# EasyEDA Pro project zhuban.epro, board PCB1
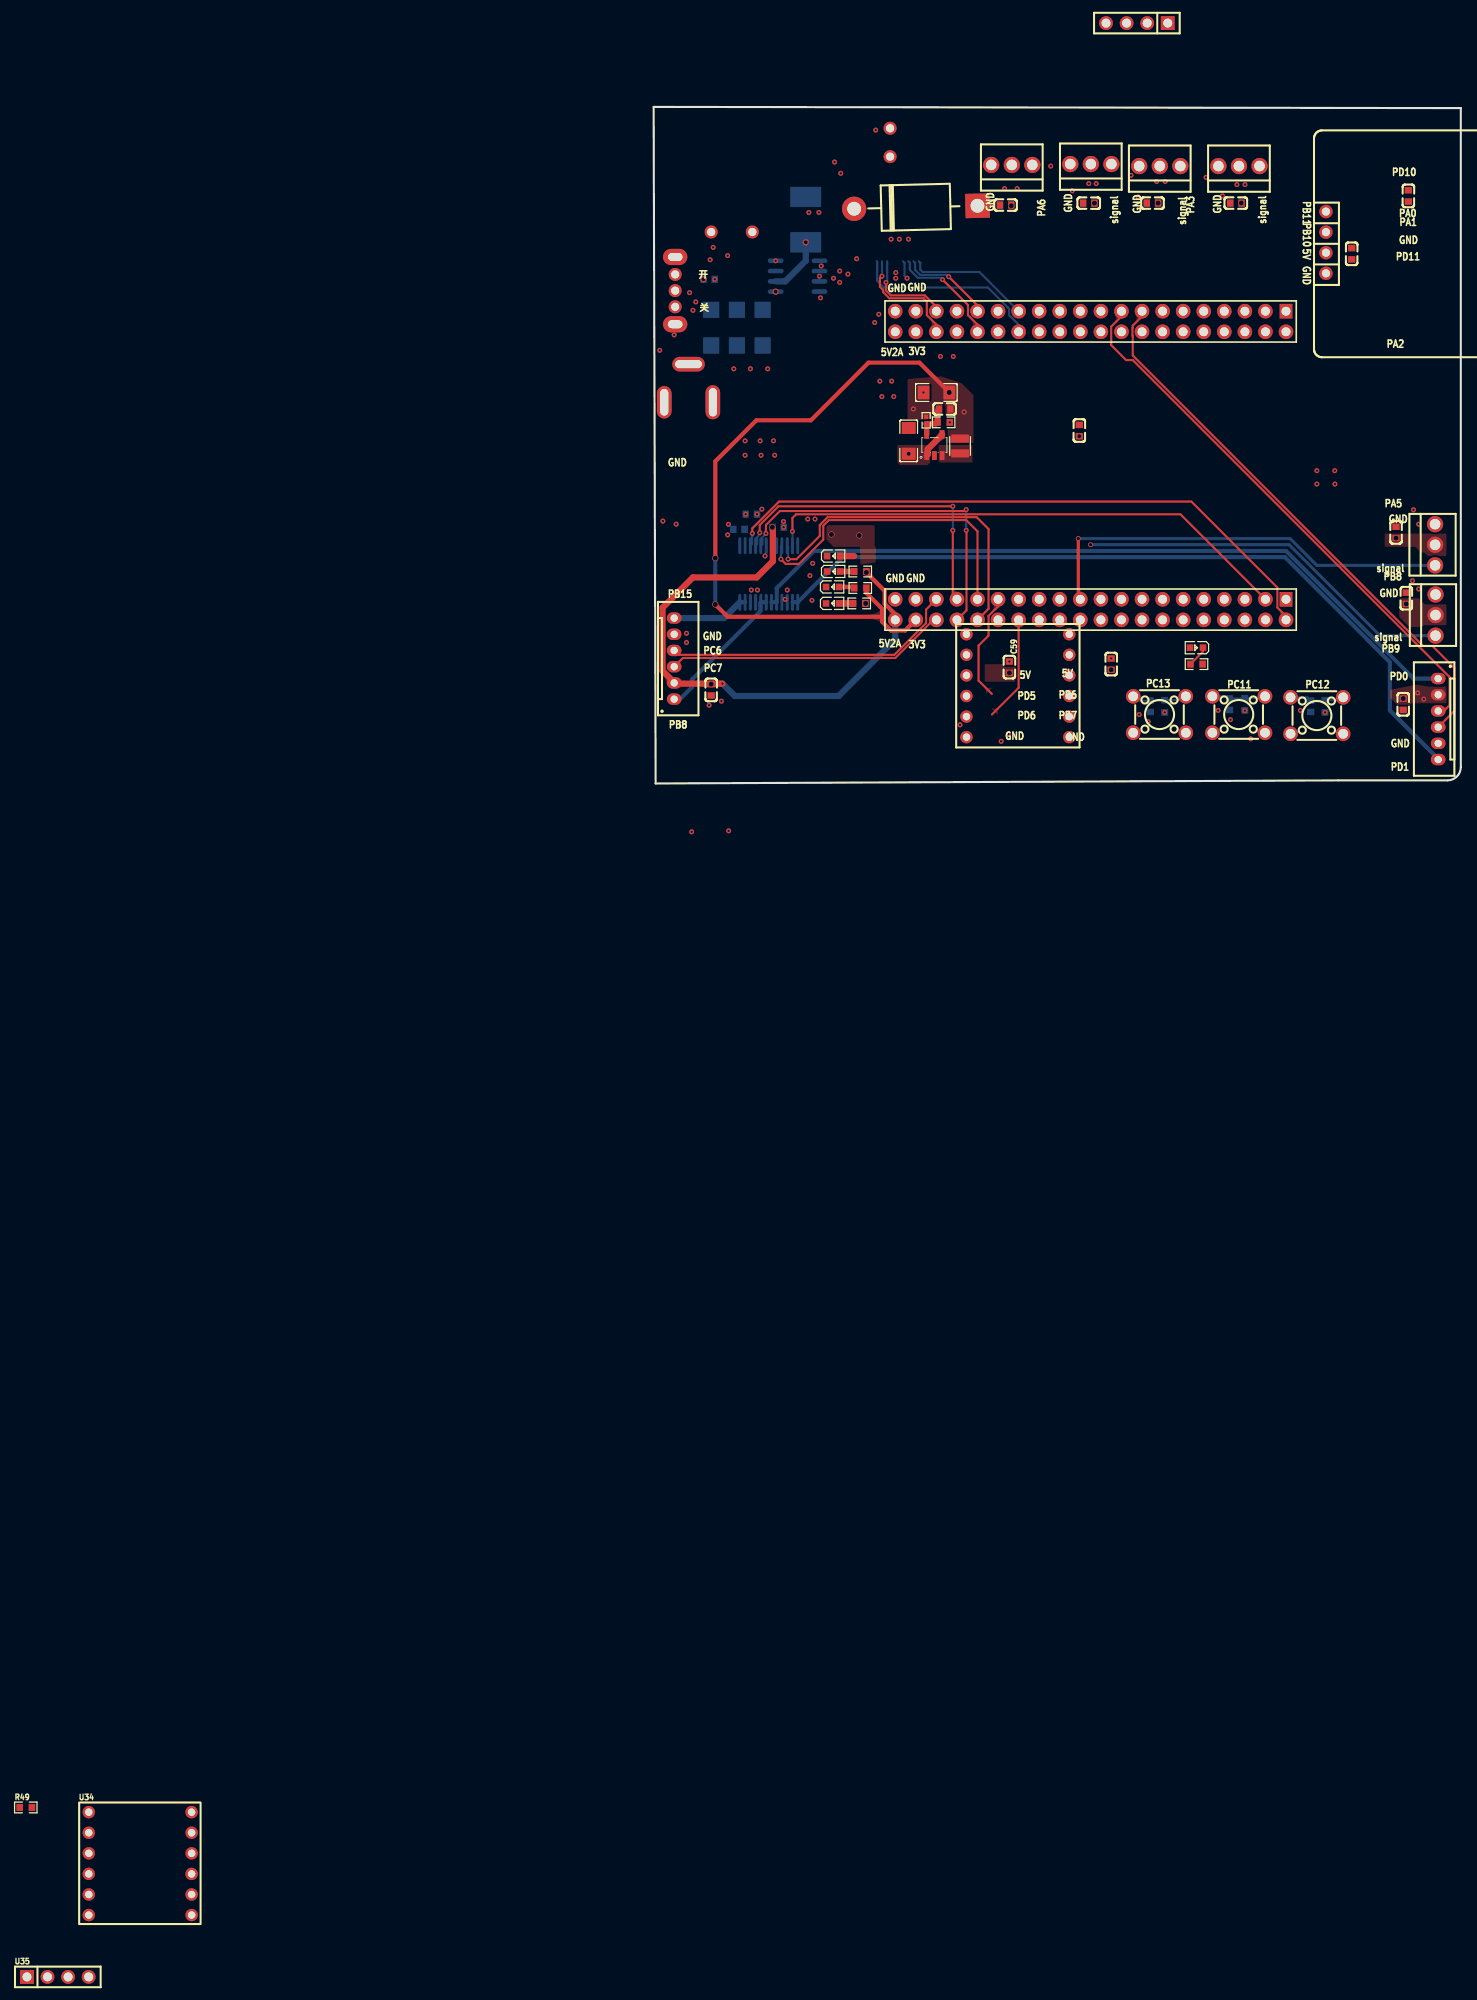
[diagram p3: board, top side]
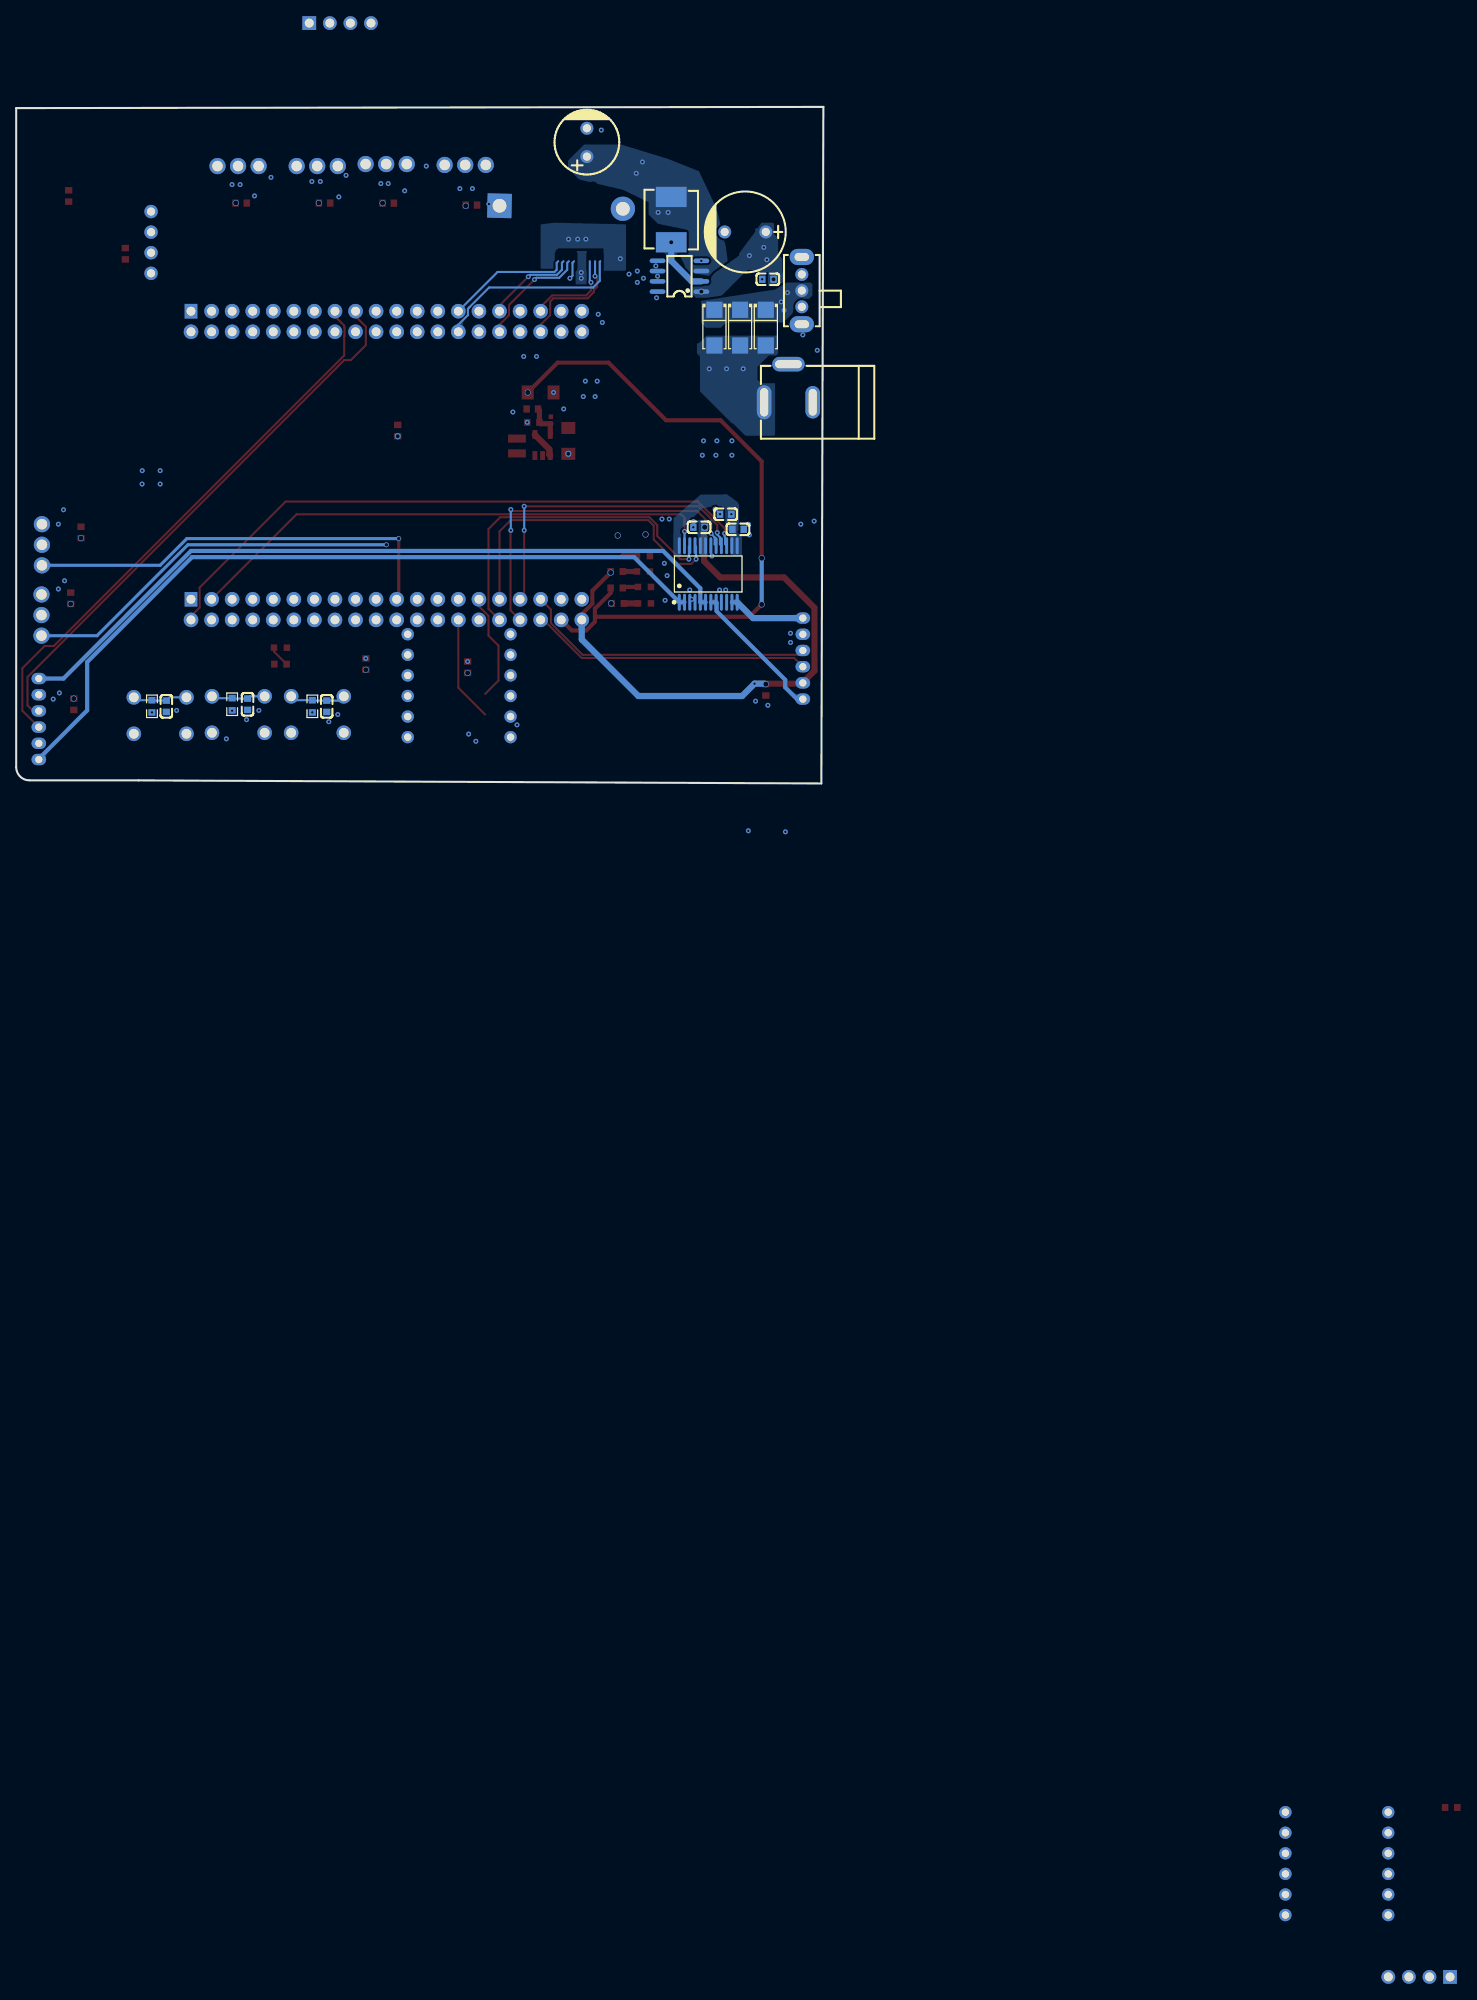
[diagram p4: board, bottom side, seen from below]

Outline 99.69 x 83.51 mm; copper layers: Top Layer, Inner1, Inner2, Bottom Layer. Coordinates in mm from the lower left corner of the outline.
Outline path: 0,83.51 0.25,0 84.58,0.38 98.06,0.39 arc(99.21,0.86) 99.69,2.01 99.69,83.36 0,83.51
Stack: Top Layer 0.035mm 外层铜厚1oz / Dielectric1 0.2104mm 7628 RC49% 8.6mil / Inner1 0.0152mm 内层铜厚 / Dielectric2 1.065mm 1.1mm H/HOZ Copper / Inner2 0.0152mm 内层铜厚 / Dielectric3 0.2104mm 7628 RC49% 8.6mil / Bottom Layer 0.035mm 外层铜厚1oz

## Design rules (mm)
template: 自定义配置
spacing copperThickness1oz (default): track to track 0.102, other pairs 0.152 to 0.3
spacing copperThickness2oz: track to track 0.203, other pairs 0.152 to 0.3
track width copperThickness1oz (default): min 0.127, default 0.254, max 2.54
track width copperThickness2oz: min 0.203, default 0.254, max 2.54
differential pair differentialPair (default): width min 0.127, default 0.254, max 2.54; gap min 0.152, default 0.152
via viaSize (default): diameter min 0.5, default 0.61, max 10; hole min 0.3, default 0.305, max 6.3
net 12V uses sad
net $3N121 uses sad
net 5V2A uses sad
net 3V3 uses sad
net $3N5291 uses sad
net $3N5391 uses sad
net 5V3A uses sad

## Placement (name value [footprint] x y rotation side)
C6  470uF  [CAP-TH_BD10.0-P5.00-D1.0-FD]  9.65 68.07 0 bottom
C7  1uF  [C0603]  6.85 62.23 180 bottom
C8  180uF  [CAP-TH_BD8.0-P3.50-D0.6-FD]  29.2 79.12 90 bottom
C25  22uF  [C1206]  31.5 42.29 270 top
C26  22uF  [C1206]  34.92 48.26 180 top
C27  100pF  [C0603]  35.95 46.22 0 top
C33  100nF  [C0603]  12.07 33.23 0 bottom
C34  10uF  [C0603]  10.54 31.37 180 bottom
C35  100nF  [C0603]  15.36 31.62 0 bottom
C39  100nF  [C0603]  93.21 72.52 270 top
C40  100nF  [C0603]  61.61 71.64 180 top
C42  100nF  [C0603]  53.74 71.63 0 top
C43  100nF  [C0603]  86.21 65.38 90 top
C44  100nF  [C0603]  7.11 11.56 90 top
C45  100nF  [C0603]  92.58 9.78 90 top
C46  100nF  [C0603]  71.91 71.63 0 top
C48  100nF  [C0603]  52.57 43.56 270 top
C49  100nF  [C0603]  56.51 14.73 270 top
C53  100nF  [C0603]  91.69 30.99 270 top
C54  100nF  [C0603]  92.96 22.86 270 top
C55  100nF  [C0603]  71.11 9.78 90 bottom
C56  100nF  [C0603]  61.34 9.53 90 bottom
C57  100nF  [C0603]  81.15 9.53 90 bottom
C58  100nF  [C0603]  43.47 71.39 0 top
C59  100nF  [C0603]  43.94 14.35 270 top
CN1  PH2.0-6P  [PH2.0-6P 直针端子座]  2.53 10.41 90 top
CN3  PH2.0-6P  [PH2.0-6P 直针端子座]  96.9 12.95 270 top
CN5  640456-3  [CONN-TH_640456-3]  72.29 76.21 0 top
CN6  640456-3  [CONN-TH_640456-3]  62.51 76.21 0 top
CN7  640456-3  [CONN-TH_640456-3]  54 76.45 0 top
CN8  640456-3  [CONN-TH_640456-3]  44.23 76.35 0 top
CN14  640456-3  [CONN-TH_640456-3]  96.52 29.46 270 top
CN15  640456-3  [CONN-TH_640456-3]  96.57 20.79 270 top
D2  SS34  [SMA_L4.3-W2.6-LS5.2-RD]  10.28 56.26 270 bottom
D3  SS34  [SMA_L4.3-W2.6-LS5.2-RD]  7.11 56.26 270 bottom
D4  SS34  [SMA_L4.3-W2.6-LS5.2-RD]  13.46 56.26 270 bottom
DC1  DC-005-5A-2.0  [DC-IN-TH_DC-005-5A-2.0]  4.31 49.4 0 bottom
L2  68uH  [IND-SMD_L7.1-W6.6-1]  18.79 69.6 270 bottom
L3  2.2uH  [IND-SMD_L2.5-W2.0_MHCD252012A]  37.84 41.66 90 top
LED1  XL-1608SURC-06  [LED0603-RD_RED]  22.22 28.07 0 top
LED3  XL-1608SURC-06  [LED0603-RD_RED]  22.22 26.16 0 top
LED8  XL-1608SURC-06  [LED0603-RD_RED]  22.09 22.22 0 top
LED9  XL-1608SURC-06  [LED0603-RD_RED]  22.09 24.26 0 top
LED10  XL-1608SURC-06  [LED0603-RD_RED]  67.05 16.76 180 top
OLED1  -  [0.96OLED_4P]  83.04 66.78 90 top
R5  10kΩ  [R0603]  25.52 26.16 180 top
R29  10kΩ  [R0603]  73.02 9.78 270 bottom
R31  450kΩ  [R0402]  33.66 44.83 90 top
R32  100kΩ  [R0603]  35.82 44.57 0 top
R44  10kΩ  [R0603]  25.39 22.22 180 top
R45  10kΩ  [R0603]  25.52 24.13 180 top
R46  10kΩ  [R0603]  67.05 14.73 0 top
R47  10kΩ  [R0603]  63.11 9.53 270 bottom
R48  10kΩ  [R0603]  82.93 9.53 270 bottom
R49  10kΩ  [R0603]  -77.54 -126.39 0 top
SW1  SK12D07VG5  [SW-TH_SK12D07VG5]  2.66 60.83 90 bottom
SW4  K2-1102DP-Z4SW-04  [SW-TH_4P-L6.0-W6.0-P4.50-LS6.5]  72.26 8.51 0 top
SW5  K2-1102DP-Z4SW-04  [SW-TH_4P-L6.0-W6.0-P4.50-LS6.5]  62.48 8.51 0 top
SW6  K2-1102DP-Z4SW-04  [SW-TH_4P-L6.0-W6.0-P4.50-LS6.5]  81.91 8.38 0 top
U3  XL1509-5.0E1  [SOIC-8_L5.0-W4.0-P1.27-LS6.0-BL]  17.77 62.61 90 bottom
U4  1N5820-E3/54  [DO-201AD_BD5.3-L8.4-P12.50-D1.4-FD]  32.38 71.12 181.4 top
U23  WTH01  [JY901]  45.59 12.32 0 top
U24  ME3103AM5G  [SOT-23-5_L3.0-W1.7-P0.95-LS2.8-BR]  34.68 41.78 270 top
U28  TB6612FNG(O,C,8,EL  [SSOP-24_L8.4-W5.8-P0.65-LS7.8-BL]  14.22 25.86 180 bottom
U31  PZ2.54-2*20  [HDR-TH_40P-P2.54-V-M-R2-C20-S2.54]  53.97 21.46 180 top
U32  PZ2.54-2*20  [HDR-TH_40P-P2.54-V-M-R2-C20-S2.54]  53.97 57.02 180 top
U33  PM254-1-04-Z-8.5  [HDR-TH_4P-P2.54-V-F]  59.68 93.85 180 top
U34  JY901  [JY901#2]  -65.95 -130.78 0 top
U35  PM254-1-04-Z-8.5  [HDR-TH_4P-P2.54-V-F]  -73.58 -147.3 0 top

## Footprints (pads in the part's own frame, mm; a bottom-side part is the same pattern mirrored in y, then rotated)
0.96OLED_4P
  round 1.651 hole 1.001: 1(-3.81,0) 2(-1.27,0.003) 3(1.27,0.003) 4(3.81,0.003)
C0603
  rect 0.8x0.9 smd: 1(-0.7,0) 2(0.7,0)
C1206
  rect 1.485x1.728 smd: 1(-1.593,0) 2(1.593,0)
CAP-TH_BD8.0-P3.50-D0.6-FD
  round 1.6 hole 1: 1(-1.75,0) 2(1.75,0)
CAP-TH_BD10.0-P5.00-D1.0-FD
  round 1.6 hole 1: 1(-2.54,0) 2(2.54,0)
CONN-TH_640456-3
  round 2 hole 1.3: 1(-2.54,0) 2(0,0) 3(2.54,0)
DC-IN-TH_DC-005-5A-2.0
  oval 1.8x4.2 hole 1x3.5: 1(3,2.352)
  oval 1.8x4 hole 1x3.3: 2(-3,2.352)
  oval 4x1.8 hole 3.3x1: 3(-0.001,-2.352)
DO-201AD_BD5.3-L8.4-P12.50-D1.4-FD
  rect 3x3 hole 1.7: 1(-7.62,0)
  round 3 hole 1.7: 2(7.62,0)
HDR-TH_4P-P2.54-V-F
  rect 1.7x1.7 hole 1.1: 1(-3.81,0)
  round 1.7 hole 1.1: 2(-1.27,0) 3(1.27,0) 4(3.81,0)
HDR-TH_40P-P2.54-V-M-R2-C20-S2.54
  rect 1.575x1.8 hole 1.1: 1(-24.13,-1.27)
  round 1.8 hole 1.1: 2(-24.13,1.27) 3(-21.59,-1.27) 4(-21.59,1.27) 5(-19.05,-1.27) 6(-19.05,1.27) 7(-16.51,-1.27) 8(-16.51,1.27) 9(-13.97,-1.27) 10(-13.97,1.27) 11(-11.43,-1.27) 12(-11.43,1.27) 13(-8.89,-1.27) 14(-8.89,1.27) 15(-6.35,-1.27) 16(-6.35,1.27) 17(-3.81,-1.27) 18(-3.81,1.27) 19(-1.27,-1.27) 20(-1.27,1.27) 21(1.27,-1.27) 22(1.27,1.27) 23(3.81,-1.27) 24(3.81,1.27) 25(6.35,-1.27) 26(6.35,1.27) 27(8.89,-1.27) 28(8.89,1.27) 29(11.43,-1.27) 30(11.43,1.27) 31(13.97,-1.27) 32(13.97,1.27) 33(16.51,-1.27) 34(16.51,1.27) 35(19.05,-1.27) 36(19.05,1.27) 37(21.59,-1.27) 38(21.59,1.27) 39(24.13,-1.27) 40(24.13,1.27)
IND-SMD_L2.5-W2.0_MHCD252012A
  rect 1x2.2 smd: 1(0.913,0) 2(-0.913,0)
IND-SMD_L7.1-W6.6-1
  rect 2.5x3.8 smd: 1(-2.8,0) 2(2.8,0)
JY901
  round 1.524 hole 0.914: 1(-6.954,6.1) 2(-6.954,3.56) 3(-6.954,1.02) 4(-6.954,-1.52) 5(-6.954,-4.06) 6(-6.954,-6.6) 7(5.747,-6.6) 8(5.747,-4.06) 9(5.747,-1.52) 10(5.747,1.02) 11(5.747,3.56) 12(5.747,6.1)
JY901#2
  round 1.524 hole 0.914: 1(-3.81,3.81) 2(-3.81,1.27) 3(-3.81,-1.27) 4(-3.81,-3.81) 5(-3.81,-6.35) 6(-3.81,-8.89) 7(8.89,-8.89) 8(8.89,-6.35) 9(8.89,-3.81) 10(8.89,-1.27) 11(8.89,1.27) 12(8.89,3.81)
LED0603-RD_RED
  rect 0.8x0.8 smd: 1(-0.799,-0.004) 2(0.799,0.004)
PH2.0-6P 直针端子座
  oval 1.4x1.8 hole 0.9: 1(0,0) 2(2,0) 3(4,0) 4(6,0) 5(8,0) 6(10,0)
R0402
  rect 0.566x0.54 smd: 1(-0.433,0) 2(0.433,0)
R0603
  rect 0.806x0.864 smd: 1(-0.753,0) 2(0.753,0)
SMA_L4.3-W2.6-LS5.2-RD
  rect 2x2 smd: 1(-2.2,0) 2(2.2,0)
SOIC-8_L5.0-W4.0-P1.27-LS6.0-BL
  oval 0.569x1.95 smd: 1(-1.905,-2.705) 2(-0.635,-2.705) 3(0.635,-2.705) 4(1.905,-2.705) 5(1.905,2.705) 6(0.635,2.705) 7(-0.635,2.705) 8(-1.905,2.705)
SOT-23-5_L3.0-W1.7-P0.95-LS2.8-BR
  rect 1.1x0.6 smd: 1(1.3,-0.95) 2(1.3,0) 3(1.3,0.95) 4(-1.3,0.95) 5(-1.3,-0.95)
SSOP-24_L8.4-W5.8-P0.65-LS7.8-BL
  oval 0.364x2.082 smd: 1(-3.575,-3.491) 2(-2.925,-3.491) 3(-2.275,-3.491) 4(-1.625,-3.491) 5(-0.975,-3.491) 6(-0.325,-3.491) 7(0.325,-3.491) 8(0.975,-3.491) 9(1.625,-3.491) 10(2.275,-3.491) 11(2.925,-3.491) 12(3.575,-3.491) 13(3.575,3.491) 14(2.925,3.491) 15(2.275,3.491) 16(1.625,3.491) 17(0.975,3.491) 18(0.325,3.491) 19(-0.325,3.491) 20(-0.975,3.491) 21(-1.625,3.491) 22(-2.275,3.491) 23(-2.925,3.491) 24(-3.575,3.491)
SW-TH_4P-L6.0-W6.0-P4.50-LS6.5
  round 1.8 hole 1.2: 1(-3.25,2.25) 2(3.25,2.25) 3(-3.25,-2.25) 4(3.25,-2.25)
SW-TH_SK12D07VG5
  oval 1.6x1.6 hole 1: 1(-2,0) 2(0,0) 3(2,0)
  oval 2x3 hole 1x1.8: 4(4.15,0) 5(-4.15,0)

## Nets
3V3: C26.1 C27.2 L3.1 R31.2 R45.1 U31.38 U32.38
5V2A: C8.1 C25.2 C35.1 C39.1 C40.1 C42.2 C43.2 C44.2 C45.2 C46.2 C48.2 C49.2 C53.2 C54.2 C58.1 C59.1 CN1.2 CN3.2 CN5.2 CN6.2 CN7.2 CN8.2 CN14.2 CN15.2 L2.1 OLED1.2 R5.1 R29.2 R47.2 R48.2 U3.3 U23.2 U23.11 U24.1 U24.4 U28.19 U28.20 U31.40 U32.40 U33.1 U34.2 U34.11 U35.4
5V3A: R44.1
12V: C6.1 C7.2 C33.1 C34.1 R49.1 SW1.3 U3.1 U28.13 U28.14 U28.24
GND: C6.2 C7.1 C8.2 C25.1 C26.2 C33.2 C34.2 C35.2 C39.2 C40.2 C42.1 C43.1 C44.1 C45.1 C46.1 C48.1 C49.1 C53.1 C54.1 C55.1 C56.1 C57.1 C58.2 C59.2 CN1.5 CN3.5 CN5.1 CN6.1 CN7.1 CN8.1 CN14.1 CN15.1 DC1.2 DC1.3 LED1.1 LED3.1 LED8.1 LED9.1 OLED1.1 R32.2 R46.2 SW1.4 SW1.5 SW4.3 SW4.4 SW5.3 SW5.4 SW6.3 SW6.4 U3.4 U3.5 U3.6 U3.7 U3.8 U4.1 U23.5 U23.8 U24.2 U28.3 U28.4 U28.9 U28.10 U28.18 U31.37 U31.39 U32.37 U32.39 U33.2 U34.5 U34.8 U35.3
AM1: CN1.1 U28.7 U28.8
AM2: CN1.6 U28.11 U28.12
CM1: CN3.1 U28.5 U28.6
CM2: CN3.6 U28.1 U28.2
DUOJI1: CN5.3 U32.8
DUOJI2: CN6.3 U32.6
DUOJI3: CN7.3 U32.1
DUOJI4: CN8.3 U32.7
DUOJI5: CN14.3 U31.21
DUOJI6: CN15.3 U31.20
PA0: U32.3 U35.1
PA1: U32.4 U35.2
PA4: U32.5
PA7: U32.10
PA8: U28.17 U31.34 U34.10
PA9: U34.3
PA10: U34.4
PA15: U28.16 U31.33
PB0: U32.11
PB1: U32.14
PB4: U31.25
PB5: U31.24
PB6: U23.10 U31.23
PB7: U23.9 U31.22
PB10: OLED1.3 U32.23
PB11: OLED1.4 U32.24
PB12: U32.26
PB13: U32.25
PB14: U32.28
PB15: U32.27
PC0: U31.14
PC1: U31.15
PC2: U31.16
PC3: U31.17
PC4: U32.9
PC5: U32.12
PC6: CN1.4 U31.35
PC7: CN1.3 U31.36
PC8: U28.23 U31.3
PC9: U28.15 U31.2 U34.9
PC10: U31.7
PC11: C55.2 R29.1 SW4.1 SW4.2 U31.6
PC12: C57.2 R48.1 SW6.1 SW6.2 U31.4
PC13: C56.2 R47.1 SW5.1 SW5.2 U31.8
PD0: U28.22 U31.32
PD1: U28.21 U31.31
PD2: U31.5
PD3: U31.1
PD4: U31.30
PD5: U23.3 U31.29
PD6: U23.4 U31.28
PD7: U31.27
PD8: U32.30 U33.3
PD9: U32.29 U33.4
PD10: U32.32
PD11: U32.31
PD12: U32.34
PD13: U32.33
PD14: U32.36
PD15: U32.35
PE0: U31.19
PE1: U31.18
PE2: U31.13
PE3: U31.12
PE4: U31.11
PE5: LED10.2 U31.10
PE6: U31.9
PE7: U32.13
PE8: U32.16
PE9: CN3.4 U32.15
PE10: U32.18
PE11: CN3.3 U32.17
PE12: U32.20
PE13: U32.19
PE14: U32.22
PE15: U32.21
$1N5869: U31.26
$1N8897: LED10.1 R46.1
$3N121: D2.1 D3.1 D4.1 SW1.2
$3N2924: LED1.2 R49.2
$3N3138: LED3.2 R5.2
$3N5291: L3.2 U24.3
$3N5292: C27.1 R31.1 R32.1 U24.5
$3N5298: LED9.2 R45.2
$3N5391: D2.2 D3.2 D4.2 DC1.1
$3N6658: L2.2 U3.2 U4.2
$3N9579: LED8.2 R44.2

Pads without a net: SW1 1; U23 1 6 7 12; U32 2; U34 1 6 7 12

## Via types
v1: diameter 0.61, hole 0.305, Top Layer to Bottom Layer, 129 vias
v2: diameter 0.762, hole 0.508, Top Layer to Bottom Layer, 5 vias
v3: diameter 0.762, hole 0.635, Top Layer to Bottom Layer, 18 vias
v4: diameter 0.61, hole 0.432, Top Layer to Bottom Layer, 2 vias

## Routing (per net, layer and track width the routed paths; a pad name or vN(x,y) marks a point on that pad's centre or on a via; arc(x,y) is an arc through that point)
3V3: length 84.5
  Top Layer w0.508: 32.38,20.19 31.07,18.89 29.3,18.89 28.21,19.97 28.21,20.6 ; 28.21,20.6 28.21,21.57 26.28,23.51 R45.1 ; 28.21,20.6 28.19,20.57 9.14,20.57 v3(7.61,22.1) ; v3(36.51,48.26) 32.83,51.94 26.54,51.94 19.43,44.83 12.69,44.83 7.61,39.75 v3(7.61,27.81)
  Bottom Layer w0.508: v3(7.61,27.81) v3(7.61,22.1)
  vias: v1(32.08,46.23) v1(35.43,52.7) v1(37.01,52.7) v1(38.35,45.85)
5V2A: length 75.2
  Top Layer w0.508: v3(26.28,26.03) 28.53,23.78 28.53,22.19 29.84,20.89 U31.40
  Top Layer w0.762: 14.73,31.5 14.73,27.43 12.73,25.43 4.85,25.43 1.1,21.68 1.1,13.9 2.69,12.32 v1(8.5,12.32) ; U24.4 35.63,43.03 33.84,41.25 33.84,40.6 33.73,40.48
  Bottom Layer w0.762: 7.23,12.32 v1(8.5,12.32) 10.03,10.79 22.86,10.79 29.84,17.78 U31.40
  vias: v1(19.17,70.48) v1(20.41,70.48) v1(22.35,76.71) v1(23.11,75.31) v1(27.93,49.66) v1(28.19,47.75) v1(29.4,49.66) v1(29.66,47.75) v1(29.91,63.06) v1(29.9,62.36) v1(43.35,73.42) v1(43.94,15.05) v1(44.9,73.42) v1(53.74,74.04) v1(54.66,74.04) v1(62.13,74.3) v1(63.11,8.77) v1(63.18,74.3) v1(69.72,9.02) v1(71.24,7.87) v1(72.04,73.92) v1(73.03,73.92) v1(73.02,8.98) v1(73.74,5.51) v1(79.88,9.02) v1(81.91,38.61) v1(81.91,36.96) v1(82.93,8.77) v1(84.13,38.61) v1(84.14,36.96) v1(94.36,11.18) v1(95.12,10.41) v2(31.5,40.69) v2(52.57,42.86) v3(7.11,12.26) v3(14.66,31.62) v3(54.44,71.63) v3(56.51,14.03) v3(62.31,71.64) v3(72.57,71.65) v3(91.69,30.29) v3(92.58,10.48) v3(92.96,22.16)
5V3A:
  vias: v3(26.19,22.22)
12V:
  vias: v1(6.98,64.64) v1(7.36,66.17) v1(9.14,65.15) v1(11.3,42.29) v1(11.3,40.51) v1(11.37,33.23) v1(13.15,42.29) v1(13.27,40.51) v1(14.8,42.29) v1(14.95,40.51) v1(19.03,32.64) v1(19.93,32.64) v1(22.22,62.36) v1(22.98,63.25) v1(22.98,61.85) v1(24,62.86) v1(25.08,64.77) v1(29.33,67.18) v1(30.35,67.18) v1(31.48,67.18) v2(6.15,62.23) v2(15.07,60.71) v3(21.97,30.73) v3(25.39,30.61)
GND: length 2.3
  Bottom Layer w0.254: v1(31.3,62.36) 30.98,62.68 30.98,64.27 30.8,64.45
  vias: v1(0.76,53.47) v1(1.14,32.38) v1(2.53,55.37) v1(2.79,32) v1(4.06,18.54) v1(4.06,17.4) v1(4.69,-5.97) v1(6.85,9.65) v1(7.55,62.23) v1(8.38,10.16) v1(9.24,31.99) v1(9.15,30.68) v1(9.27,-5.84) v1(12.06,23.88) v1(12.77,33.23) v1(12.82,23.88) v1(13.37,33.85) v1(13.76,28.08) v1(15.07,64.52) v1(16.04,32.33) v1(16.06,31.62) v1(16.25,22.73) v1(16.5,23.88) v1(19.3,25.65) v1(19.64,27.17) v1(19.55,22.61) v1(20.48,62.61) v1(20.61,59.94) v1(20.7,63.88) v1(27.3,56.9) v1(27.43,80.64) v1(27.81,57.91) v1(33.33,48.26) v1(36.57,44.57) v1(37.84,7.24) v1(41.31,71.52) v1(42.92,5.21) v1(43.81,6.1) v1(49.04,76.2) v1(51.71,73.15) v1(56.51,15.43) v1(58.95,75.06) v1(59.84,72.4) v1(59.97,8.51) v1(61.08,7.62) v1(68.23,74.81) v1(70.26,72.52) v1(93.72,25.02) v1(93.85,33.78) v1(94.48,32) v1(94.48,24) v3(43.94,13.65) v3(44.17,71.31)
AM1: length 17.5
  Bottom Layer w0.508: CN1.1 3.25,10.41 4.72,11.88 4.72,12.8 13.18,21.26 13.18,22.31 U28.8 U28.7
AM2: length 9.6
  Bottom Layer w0.508: U28.11 U28.12
  Bottom Layer w0.762: U28.12 8.69,20.41 CN1.6
CM1: length 92.5
  Bottom Layer w0.508: CN3.1 93.85,12.95 78.1,28.7 19.81,28.7 15.2,24.09 U28.5 U28.6
CM2: length 96
  Bottom Layer w0.508: CN3.6 96.9,3.05 90.93,9.02 90.93,14.99 77.97,27.94 23.37,27.94 U28.1 U28.2
DUOJI5: length 53
  Top Layer w0.381: 52.7,22.73 52.45,22.99 v4(52.45,30.23)
  Bottom Layer w0.381: CN14.3 81.91,26.92 78.61,30.23 v4(52.45,30.23)
DUOJI6: length 47.2
  Bottom Layer w0.381: CN15.3 89.7,18.25 78.48,29.46 v4(53.97,29.46)
PA8: length 42.5
  Top Layer w0.254: v1(38.6,31.24) 38.64,31.21 38.64,21.37 U31.34 ; v1(13.87,30.86) 13.87,31.91 15.59,33.63 38.43,33.63 v1(38.6,33.81)
  Bottom Layer w0.254: U28.17 13.44,29.54 13.44,30.4 13.87,30.83 v1(13.87,30.86) ; v1(38.6,33.81) v1(38.6,31.24)
PA15: length 39.3
  Top Layer w0.254: v1(13.11,30.96) 13.11,31.91 15.41,34.21 v1(36.95,34.21) ; v1(36.95,31.24) 36.95,23.24 37.46,22.73
  Bottom Layer w0.254: v1(36.95,34.21) v1(36.95,31.24) ; U28.16 12.79,29.54 12.79,30.4 13.11,30.72 v1(13.11,30.96)
PB14: length 23.5
  Bottom Layer w0.254: 27.55,64.45 27.62,64.39 27.62,62.04 28.44,61.21 41.29,61.21 43.72,58.78 43.72,58.77 43.9,58.58 43.9,57.8 45.08,56.63 U32.28
PB15: length 15.4
  Bottom Layer w0.254: U32.27 40.24,63.13 33.21,63.13 32.94,63.4 32.94,64.27 32.75,64.45
PC6: length 36.4
  Top Layer w0.254: 34.92,22.73 33.65,21.46 33.65,19.8 29.73,15.88 3.07,15.88 CN1.4
PC7: length 34.8
  Top Layer w0.254: CN1.3 3.61,15.49 29.85,15.49 34.55,20.19 34.92,20.19
PC8: length 66.4
  Top Layer w0.254: 75.56,22.73 65.07,33.22 17.6,33.22 17.14,32.77 v1(17.14,31.11)
  Bottom Layer w0.254: v1(17.14,31.11) 17.15,31.11 U28.23
PC9: length 77.3
  Top Layer w0.254: 78.1,20.19 78.1,20.65 77.03,21.72 77.03,24.18 66.42,34.8 15.49,34.8 12.19,31.5 v1(12.19,30.86)
  Bottom Layer w0.254: U28.15 12.14,29.54 12.14,30.4 12.19,30.45 v1(12.19,30.86)
PC11: length 6.7
  Bottom Layer w0.254: SW4.1 70.83,10.76 C55.2 72.97,10.48 R29.1 75.28,10.53 SW4.2
PC12: length 6.8
  Bottom Layer w0.254: SW6.1 80.74,10.63 C57.2 82.87,10.22 R48.1 84.81,10.28 SW6.2
PC13: length 6.9
  Bottom Layer w0.254: SW5.1 59.76,10.22 C56.2 63.06,10.22 R47.1 65.25,10.28 SW5.2
PD0: length 41.8
  Top Layer w0.254: U31.32 41.36,21.55 41.36,31.41 39.9,32.87 21.49,32.87 20.52,31.89 20.52,30.56 17.65,27.69 v1(16.61,27.69)
  Bottom Layer w0.254: U28.22 16.61,29.24 v1(16.61,27.69)
PD1: length 38.4
  Top Layer w0.254: v1(15.72,27.69) 16.3,27.1 17.95,27.1 20.95,30.1 20.95,31.82 21.64,32.51 38.6,32.51 40,31.11 40,22.73
  Bottom Layer w0.254: U28.21 15.72,29.22 v1(15.72,27.69)
PD5: length 13.4
  Top Layer w0.254: 41.78,11.05 40.13,12.7 40.13,17.02 41.36,18.25 41.36,20.68 42.54,21.86 42.54,22.73
PD6: length 13.1
  Top Layer w0.254: 41.78,8.51 45.08,11.81 U31.28
PD10: length 13.9
  Top Layer w0.254: U32.32 40,56.63 38.82,57.8 38.82,59.05 v1(35.68,62.19)
  Bottom Layer w0.254: 31.45,64.45 31.64,64.27 31.64,63.4 32.62,62.42 35.45,62.42 v1(35.68,62.19)
PD11: length 11.4
  Top Layer w0.254: U32.31 40,58.99 v1(36.44,62.55)
  Bottom Layer w0.254: v1(36.44,62.55) 36.22,62.78 32.92,62.78 32.29,63.4 32.29,64.27 32.1,64.45
PD14: length 14.2
  Top Layer w0.254: v1(28.2,62.61) 27.95,62.36 27.95,61.31 28.36,60.9 28.36,60.64 29.11,59.89 33.35,59.89 33.74,59.49 33.74,57.8 34.92,56.63 34.92,55.75
  Bottom Layer w0.254: 28.2,64.45 v1(28.2,62.61)
PD15: length 11.3
  Top Layer w0.254: v1(28.7,61.85) 28.71,61.83 28.71,60.83 29.3,60.24 33.5,60.24 34.92,58.82 34.92,58.29
  Bottom Layer w0.254: v1(28.7,61.85) 28.85,62 28.85,64.45
PE9: length 69.8
  Top Layer w0.254: 60.32,58.29 60.32,57.66 59.18,56.52 59.18,56.28 59.14,56.24 59.14,55.26 59.18,55.23 59.18,52.83 95.04,16.97 96.18,16.97 98.93,14.22 98.93,8.99 CN3.4
PE11: length 68.6
  Top Layer w0.254: CN3.3 97.59,8.95 98.29,9.65 98.29,13.14 59.18,52.26 58.35,52.26 56.51,54.1 56.51,56.39 57.78,57.66 U32.17
$1N8897: length 2.7
  Top Layer w0.254: LED10.1 67.85,16.28 R46.1
$3N121:
  vias: v1(4.44,60.58) v1(4.86,58.4) v1(5.2,59.44)
$3N2924: length 1.8
  Top Layer w0.762: 24.77,28.07 23.02,28.07 LED1.2
$3N3138: length 1.8
  Top Layer w0.635: LED3.2 23.02,26.16 R5.2
$3N5292: length 4.5
  Top Layer w0.635: C27.1 35.07,46.04 R32.1 34.89,44.39 R31.1 33.73,44.33 33.73,43.08
$3N5298: length 1.9
  Top Layer w0.508: 24.77,24.26 22.9,24.26 LED9.2
$3N5391:
  vias: v1(9.9,51.18) v1(11.95,51.18) v1(14.09,51.18)
$3N6658: length 7.1
  Bottom Layer w0.762: U3.2 16.25,61.98 18.79,64.52 v2(18.79,66.8)
$3N9579: length 1.8
  Top Layer w0.762: R44.2 22.9,22.22 LED8.2

## Copper pours and planes (outline as drawn; the poured copper is in the pictures)
3V3 on Top Layer: 34.92,50.22 35.59,50.22 38.04,49.4 39.49,47.95 39.49,42.04 36.23,42.04 36.32,42.13 36.32,43.69 37.33,43.69 37.33,45.34 36.06,45.34 36.06,46.59 36.03,46.63 34.54,46.63 34.54,44.89 31.36,44.89 31.36,49.91 34.16,50.16 34.29,50.16 34.54,50.09
3V3 on Inner1: 37.97,54.23 38.31,47.37 37.08,47.37 35.25,47.57 34.92,52.07 34.67,52.32 33.9,52.32 31.36,54.86 31.36,54.99 31.16,57.02 31.16,57.28 33.4,57.28 33.52,57.15 33.52,55.91 34.69,54.74 37.46,54.74
5V2A on Top Layer: 43.15,70.88 45.12,70.88 45.63,71.39 45.63,76.73 45.51,76.85 45.51,77.74 45.25,78 43.6,78 43.47,78.12 43.09,77.74 42.84,77.74 42.84,71.19
5V2A on Top Layer: 61.87,70.55 61.87,73.79 61.11,74.55 61.11,77.48 61.24,77.6 62.13,77.98 62.49,77.83 63.04,77.83 63.78,77.09 63.78,73.67 63.91,73.54 63.91,70.36 62.05,70.36
5V2A on Top Layer: 90.3,31 90.3,29.21 94.05,29.21 94.74,28.53 95.17,28.53 95.63,28.07 97.79,28.07 97.91,28.19 97.91,30.73 98.04,30.86 90.44,30.86
5V2A on Top Layer: 53.73,70.41 53.35,72.6 53.11,74.17 52.71,76.37 52.73,76.71 52.73,77.72 52.98,77.98 54.27,78.11 54.5,78.11 55.27,77.34 55.27,70.61 55.39,70.48 55.32,70.41
5V2A on Top Layer: 92.25,22.87 94.5,22.87 95.27,22.1 97.91,22.1 97.91,19.53 95.08,19.53 94.86,19.3 93.34,19.3 92.07,20.57 92.07,22.69
5V2A on Top Layer: 44.77,14.36 44.65,14.24 44.65,12.57 40.89,12.57 40.89,14.73 44.39,14.73
5V2A on Top Layer: 30.09,41.66 30.09,39.61 30.41,39.3 33.83,39.3 34.16,39.62 34.16,41.66 34.03,41.78 30.22,41.78
5V2A on Top Layer: 90.93,10.65 90.93,11.56 94.23,12.19 95.75,11.94 97.53,11.94 97.66,12.06 98.4,11.33 98.4,10.5 97.8,9.91 93.59,9.91 93.34,9.65 91.92,9.65
5V2A on Top Layer: 71.9,70.86 70.89,74.17 70.89,76.81 71.02,77.09 72.16,78.24 73.43,78.24 73.81,77.86 73.81,70.62 73.94,70.49 72.27,70.49
5V2A on Bottom Layer: 13.99,62.61 16.76,63.12 17.84,65.46 16.76,65.46 16.76,68.33 20.44,69.09 21.58,70.23 21.58,71.75 24.76,73.28 30.17,74.55 31.53,75.9 31.53,77.09 30.98,77.63 30.98,78.87 28.22,78.87 27.92,79.16 25.94,79.16 19.17,77.09 15.36,75.56 13.2,71.01 12.06,66.33 11.81,64.39
5V2A on Bottom Layer: 15.62,32.54 15.49,28.19 15.37,28.08 14.22,28.08 14.22,30.91 14.01,31.11 13.71,31.11 13.71,32.38 13.86,32.54
5V2A on Bottom Layer: 30.59,61.53 30.59,63.25 30.48,63.37 30.48,65.72 29.27,65.72 29.2,65.79 28.7,61.47 30.45,61.39
12V on Top Layer: 21.33,31.88 21.33,30.1 22.22,29.21 25.39,29.21 25.52,29.08 25.52,27.1 25.57,27.05 27.43,27.28 27.43,29.21 27.3,29.34 27.3,31.75 27.17,31.88
12V on Bottom Layer: 12.06,31.21 11.68,30.83 11.68,28.96 11.55,28.83 11.55,28.37 11.26,28.08 10.05,28.08 10.05,30.43 10.66,31.05 10.41,31.3 10.41,34.29 10.57,34.72 11.9,35.69 15.16,35.66 18.49,32.77 18.55,29.91 18.54,29.71 18.53,28 18.25,28.08 17.4,28.04 17.43,30.33 17.39,30.48 17.39,31.5 14.85,34.04 14.47,34.04 13.63,34.24 12.64,34.22 12.19,34.08
12V on Bottom Layer: 24.38,63.34 24.39,69.01 33.14,69.22 34.92,69 34.92,63.07 33.9,62.99 33.52,63.12 33.09,63.12 33.09,65.71 32.76,66.04 27.16,66.04 27.16,63.28 24.56,63.28
12V on Bottom Layer: 7.63,69.22 6.22,69.22 6.09,69.09 6.09,67.82 5.58,67.31 5.58,65.28 5.08,64.77 5.08,63.12 4.95,62.99 4.95,61.95 5.43,61.47 6.6,61.47 6.73,61.34 6.86,61.48 6.86,63.12 8.38,63.12 8.63,63.37 9.39,63.37 12.57,60.2 14.51,59.94 15.74,59.94 16.27,60.48 16.27,61.03 15.84,61.47 14.04,61.47 13.83,62.56 13.46,62.99 10.41,65.15 10.41,65.41 8.25,68.33
12V on Inner1: 13.84,61.47 13.84,59.44 21.84,59.44 26.16,63.75 26.16,65.66 26.03,65.79 22.35,65.79 22.22,65.66 21.97,63.37 20.48,61.98
$3N121 on Bottom Layer: 15.11,59.56 5.96,60.96 4.48,61.85 1.6,61.85 1.35,61.6 1.35,60.24 1.77,59.82 3.17,59.82 3.55,59.18 3.8,58.04 4.95,56.9 12.01,56.9 12.64,56.26 14.53,56.26 15.11,56.84
$3N5291 on Top Layer: 35.18,41.78 35.18,39.75 35.3,39.62 39.36,39.62 39.36,41.73 39.23,41.78
$3N5391 on Bottom Layer: 5.96,49.4 7.71,49.4 8.12,49.81 8.12,51.44 6.73,52.83 5.84,52.83 5.58,53.09 5.58,55.14 5.73,55.28 14.44,55.28 15.36,54.36 15.62,54.36 15.62,53.09 15.23,52.7 15.23,48.39 11.3,44.45 11.17,44.45 9.65,42.93 6.09,42.93 5.96,43.05

Small or netless copper shapes (teardrops, artwork), in the pictures only: 59 on Top Layer, 35 on Bottom Layer

## Text on the board
Top Silkscreen Layer: GND | PB15 | PB8 | PC6 | PC7 | PD5 | PD6 | 5V | PB6 | PB7 | PC13 | PC11 | PC12 | signal | PB9 | PA5 | PA2 | PD0 | PD1 | PD10 | PD11 | PA0 | PA1 | PA6 | PA3 | PB11 | PB10 | 5V2A | 3V3 | 关 | 开
